# EAGLE design BRD161205 (EAGLE 7.6.0)
REV: R00.0x; TITLE: PM6665 10MHz reference oscillator
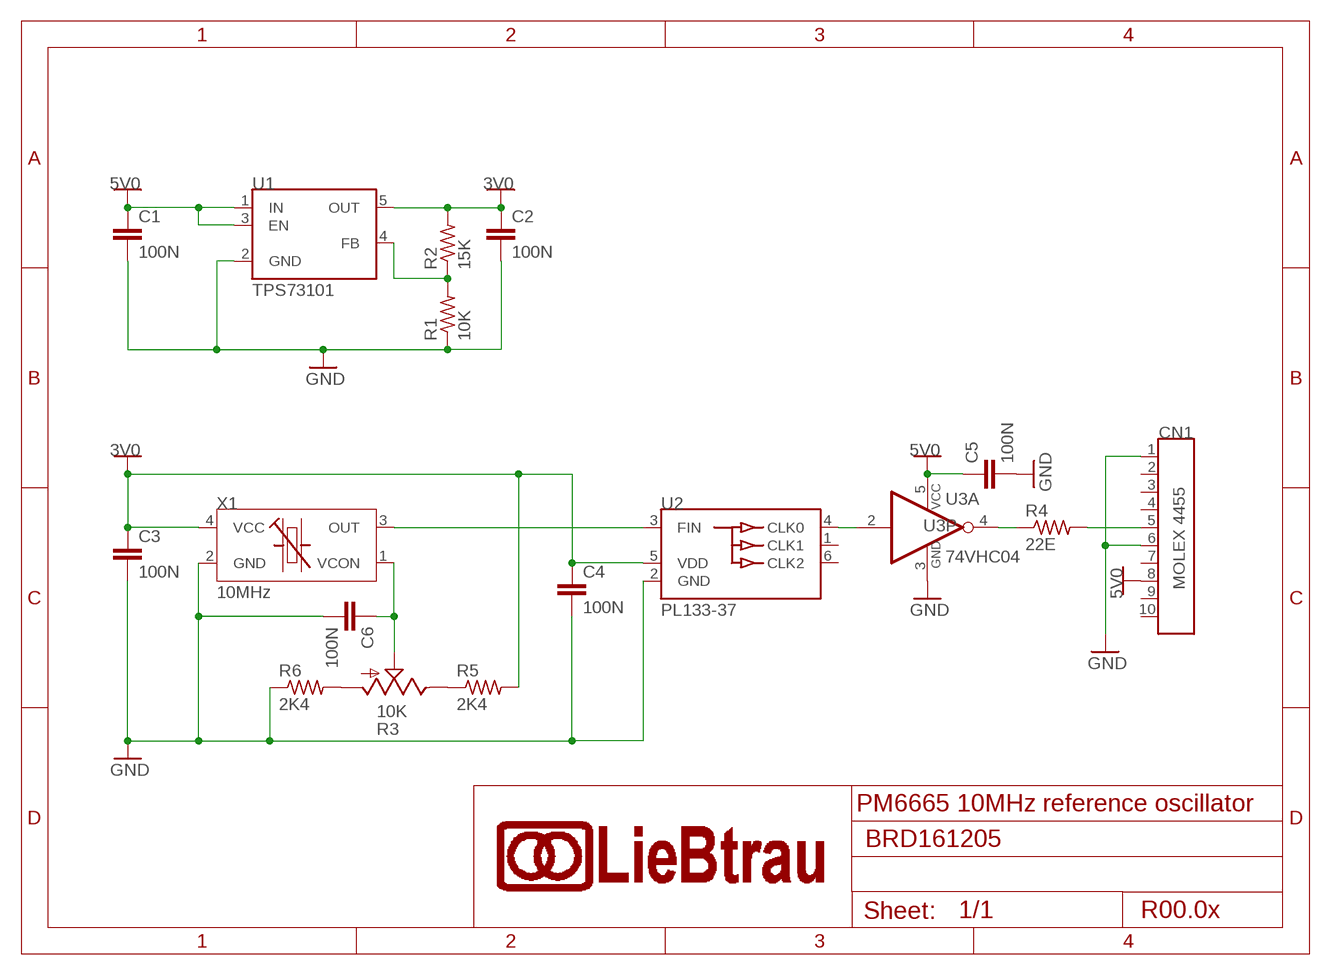
[diagram p0: schematic, sheet 1]

## Parts
C1  100N  CA_100N_1206  [CA_1206]
C2  100N  CA_100N_1206  [CA_1206]
C3  100N  CA_100N_1206  [CA_1206]
C4  100N  CA_100N_1206  [CA_1206]
C5  100N  CA_100N_1206  [CA_1206]
C6  100N  CA_100N_1206  [CA_1206]
CN1  MOLEX 4455  CN_10P_MOLEX_4455_  [CN_HDR1X10_90D_P254_MOLEX_4455]
R1  10K  RE_10K_1206  [RE_1206]
R2  15K  RE_15K_1206  [RE_1206]
R3  10K  RE_TRIM_10K_TH_90D_P25  [RE_TRIM_TH_90D_P25]
R4  22E  RE_22E_1206  [RE_1206]
R5  2K4  RE_2K4_1206  [RE_1206]
R6  2K4  RE_2K4_1206  [RE_1206]
U1  TPS73101  IC_TPS73101_TPS73101_SOT23-5  [SC_SOT23-5]
U2  PL133-37  IC_PL133-37_TC-R_SOT23-6  [SC_SOT23-6]
U3  74VHC04  IC_7404_VHC1GT_SOT23-5  [SC_SOT23-5]
X1  10MHz  XT_VCTCXO_10MHZ_3225  [XT_3225]

## Nets
3V0: C2.1 C3.1 C4.1 R2.2 R5.2 U1.5(OUT) U2.5(VDD) X1.4(VCC)
5V0: C1.1 C5.1 CN1.8 U1.1(IN) U1.3(EN) U3.5(P:VCC)
GND: C1.2 C2.2 C3.2 C4.2 C5.2 C6.2 CN1.1 CN1.6 R1.1 R6.1 U1.2(GND) U2.2(GND) U3.3(P:GND) X1.2(GND)
N$1: R1.2 R2.1 U1.4(FB)
N$2: C6.1 R3.2 X1.1(VCON)
N$3: U2.4(CLK0) U3.2(A:I)
N$4: U2.3(FIN) X1.3(OUT)
N$5: R4.1 U3.4(A:O)
N$6: CN1.5 R4.2
N$7: R3.3 R5.1
N$8: R3.1 R6.2
Unconnected: CN1.2 CN1.3 CN1.4 CN1.7 CN1.9 CN1.10 U2.1(CLK1) U2.6(CLK2)

## Library data of the parts
C1-C6 = lieBtrau:CA; COST: 0.09; ORDERCODE: 399-1249-1-ND
CN1 = lieBtrau:CN_10P; COST: 1.18; ORDERCODE: WM3219-ND
R1 = lieBtrau:RE: Yageo RC1206 Stackpole RMCF1206; COST: 0.09; ORDERCODE: 311-10.0KFRCT-ND
R2 = lieBtrau:RE: Yageo RC1206 Stackpole RMCF1206; COST: 0.09; ORDERCODE: 311-15.0KFRCT-ND
R3 = lieBtrau:RE_TRIM; COST: 0.82; ORDERCODE: CT6EX103-ND
R4 = lieBtrau:RE: Yageo RC1206 Stackpole RMCF1206; COST: 0.09; ORDERCODE: 311-22.0FRCT-ND
R5 R6 = lieBtrau:RE: Yageo RC1206 Stackpole RMCF1206; COST: 0.09; ORDERCODE: 311-2.40KFRCT-ND
U1 = lieBtrau:IC_TPS73101; COST: 0.95; ORDERCODE: 296-27058-1-ND
U2 = lieBtrau:IC_PL133-37; COST: 2.55; ORDERCODE: 576-4933-1-ND
U3 = lieBtrau:IC_7404; COST: 0.37; ORDERCODE: M74VHC1GT04DTT1GOSCT-ND
X1 = lieBtrau:XT_VCTCXO; COST: 2.62; ORDERCODE: 1664-1262-1-ND

## Board
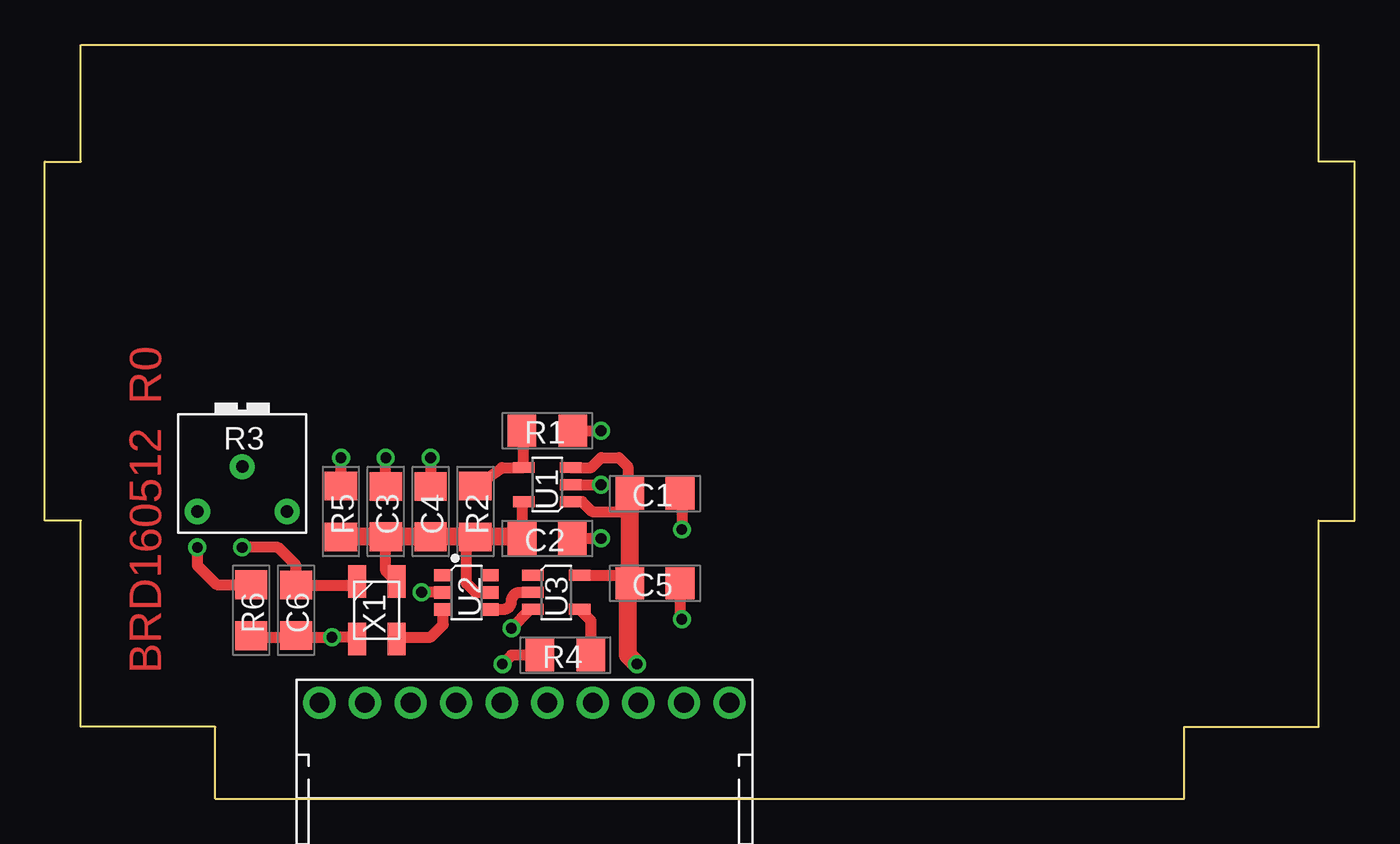
[diagram p1: board, top side]
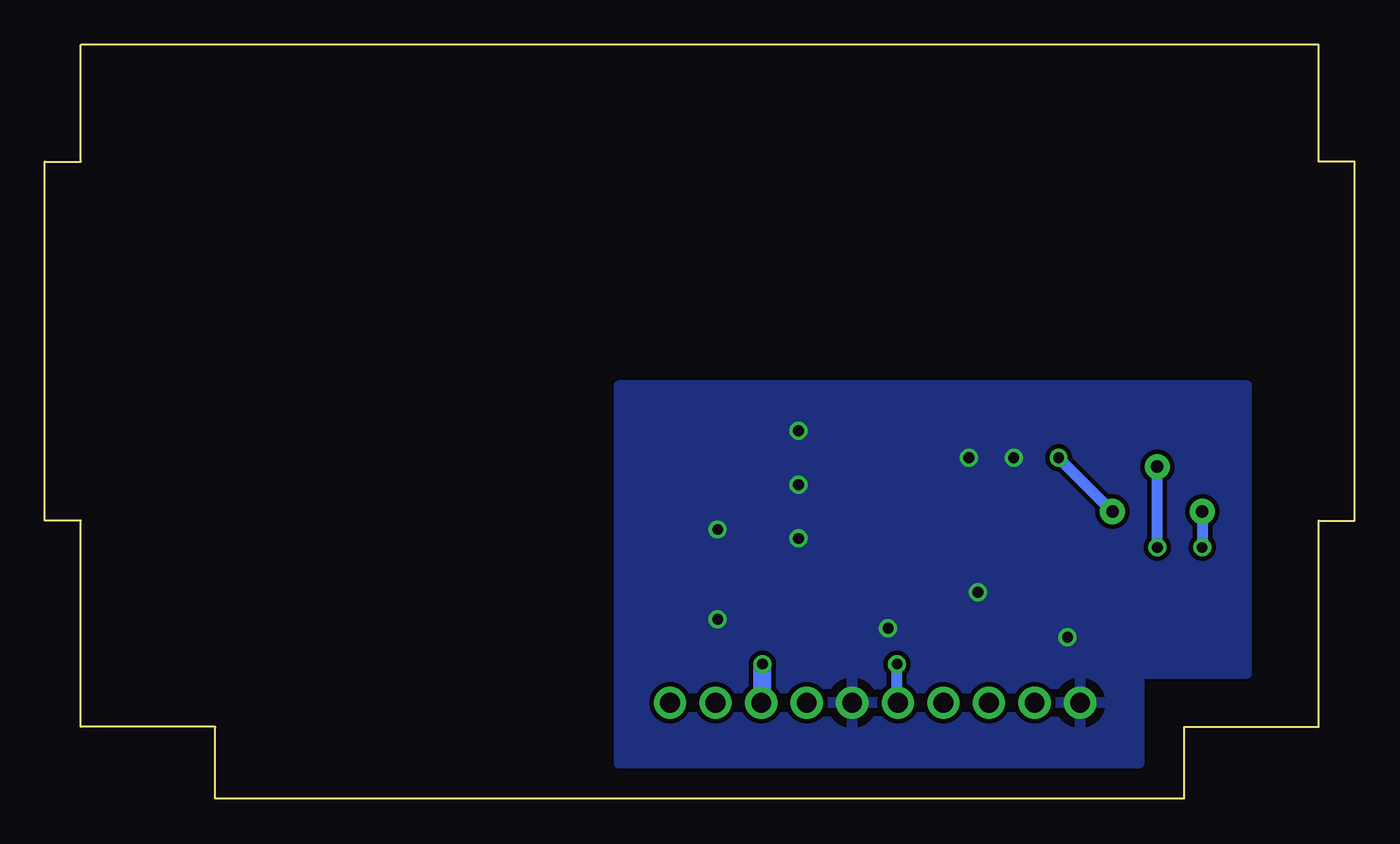
[diagram p2: board, bottom side, seen from below]

Size 73 x 42 mm. Coordinates in mm from the lower left corner, seen from the top.
Outline: 9.5,0 63.5,0 63.5,4 71,4 71,15.5 73,15.5 73,35.5 71,35.5 71,42 2,42 2,35.5 0,35.5 0,15.5 2,15.5 2,4 9.5,4 9.5,0
Copper layers (1*16): Top 0.035mm / dielectric 1.5mm / Bottom 0.035mm
Design rules "dtron *": minimum track width 0.175mm, minimum drill 0.6mm, track to track 0.25mm, track to pad 0.25mm, pad to pad 0.2mm, via to via 0.25mm, smd to smd 0.2mm, copper to edge 0.5mm, drill to drill 0.2mm, minimum pad ring 0.25mm, minimum via ring 0.2mm, stop-mask expansion 0.1mm, vias tented up to drill 0mil, thermal gap 0.5mm

### Footprints (pad centres in the part's own frame; a part is rotated, then mirrored left to right if it is on the bottom)
CA_1206 = smd 1.6 x 1.8: 1 -1.4,0; 2 1.4,0
CN_HDR1X10_90D_P254_MOLEX_4455 = drill 1.1 pad 1.8: 1 0,0; 2 2.54,0; 3 5.08,0; 4 7.62,0; 5 10.16,0; 6 12.7,0; 7 15.24,0; 8 17.78,0; 9 20.32,0; 10 22.86,0
RE_1206 = smd 1.6 x 1.803: 1 -1.422,0; 2 1.422,0
RE_TRIM_TH_90D_P25 = drill 0.7 pad 1.4: 1 -2.5,-2.5; 2 0,0; 3 2.5,-2.5
SC_SOT23-5 = smd 1.2 x 0.6: 1 -1.306,0.95; 2 -1.306,0; 3 -1.306,-0.95; 4 1.306,-0.95; 5 1.306,0.95
SC_SOT23-6 = smd 0.69 x 1: 1 -0.95,-1.3; 2 0,-1.3; 3 0.95,-1.3; 4 0.95,1.3; 5 0,1.3; 6 -0.95,1.3
XT_3225 = smd 1.8 x 1: 1 1.6,1.1; 2 -1.6,1.1; 3 -1.6,-1.1; 4 1.6,-1.1

### Placement (x,y rotation side)
C1  34,17 0 top
C2  28,14.5 0 top
C3  19,16 90 top
C4  21.5,16 90 top
C5  34,12 0 top
C6  14,10.5 270 top
CN1  15.3,5.35 0 top
DRILEGEND  [DRILEGEND]  1.48,-5.83 0 top  (outside the outline)
R1  28,20.5 180 top
R2  24,16 270 top
R3  11,18.5 0 top
R4  29,8 180 top
R5  16.5,16 270 top
R6  11.5,10.5 90 top
U1  28,17.5 180 top
U2  23.5,11.5 270 top
U3  28.5,11.5 0 top
U$6  [FR_FRAME_A5]  -55,-53 0 top  (outside the outline)
X1  18.5,10.5 90 top

### Tracks (layer width: path | path; a pad name or v marks a point on that pad's centre or on a via)
3V0
  Top 0.406: C4.1 22,14.6
  Top 0.61: 23.5,14.6 23.5,12 24,11.5 U2.5 | R2.2 23.98,14.6 22,14.6 | U1.5 26.6,16.46 C2.1 | X1.4 19,12.7 C3.1
  Top 1.016: C2.1 26.5,14.6 23.5,14.6 22,14.6 | C4.1 C3.1 16.52,14.6 R5.2
5V0  (via drill 0.6)
  Top 0.61: U3.5 32.6,12.45 C5.1 | U1.1 29.95,16.55 30.5,16 32.6,16 | U1.3 30.45,18.45 31,19 32,19 32.5,18.5 32.5,17.1 C1.1
  Top 1.016: 32.6,12.45 32.6,16 C1.1 | v33,7.5 32.5,8 32.5,11.5 32.6,11.6 C5.1
  Bottom 1.016: CN1.8 33,5.43 v33,7.5
GND  (via drill 0.6)
  Top 0.61: U1.2 v31,17.5 | C1.2 35.5,17.1 v35.5,15 | R1.1 v31,20.5 | 29,14.1 C2.2 v31,14.5 | C3.2 v19,19 | C5.2 35.4,10.1 v35.5,10 | U2.2 v21,11.5 | 22.1,17.4 C4.2 v21.5,19 | v26,9.5 27.05,10.55 U3.3 | X1.2 17.2,9.1 17.2,9 v16,9 | R6.1 11.5,9 v16,9 | C6.2 14,9 v16,9
  pour Bottom: 6,23 41,23 41,2 12,2 12,7 6,7
N$1
  Top 0.61: R1.2 26.69,20.38 U1.4 25.47,18.45 R2.1
N$2  (via drill 0.6)
  Top 0.61: X1.1 17.2,11.9 C6.1 14,13 13,14 v11,14
  Bottom 0.61: v11,14 R3.2
N$3
  Top 0.61: U2.4 25.55,10.55 arc90 26,11 arc-90 26.5,11.5 U3.2
N$4
  Top 0.61: X1.3 19.6,9 21.5,9 22.2,9.7 U2.3
N$5
  Top 0.61: U3.4 30.42,9.93 R4.1
N$6  (via drill 0.6)
  Top 0.61: R4.2 26,8 v25.5,7.5
  Bottom 0.61: CN1.5 25.5,5.39 v25.5,7.5
N$7  (via drill 0.6)
  Top 0.61: R5.1 v16.5,19
  Bottom 0.61: v16.5,19 R3.3
N$8  (via drill 0.6)
  Top 0.61: v8.5,14 8.5,13 9.58,11.92 R6.2
  Bottom 0.61: R3.1 v8.5,14